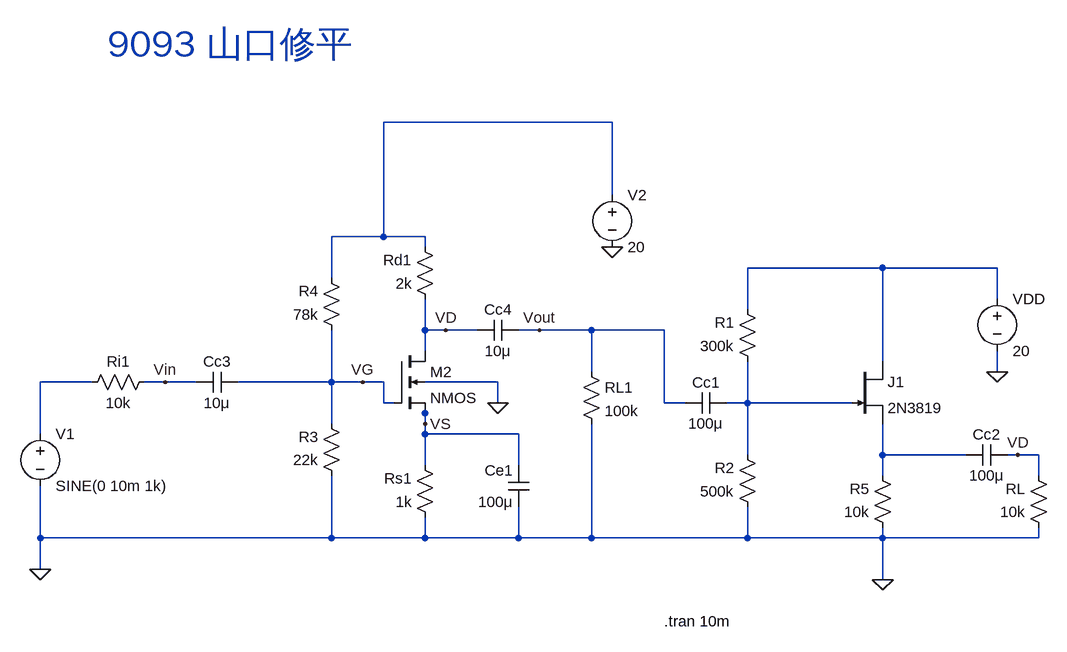
[diagram p0: schematic Draft3.asc]
Draft3.asc, the LTspice schematic file:
Version 4
SHEET 1 1700 776
WIRE 1024 -128 672 -128
WIRE 1024 -16 1024 -128
WIRE 672 48 672 -128
WIRE 672 48 592 48
WIRE 736 48 672 48
WIRE 736 64 736 48
WIRE 1440 96 1232 96
WIRE 1616 96 1440 96
WIRE 592 112 592 48
WIRE 1616 144 1616 96
WIRE 1232 160 1232 96
WIRE 736 192 736 144
WIRE 768 192 736 192
WIRE 816 192 768 192
WIRE 912 192 880 192
WIRE 992 192 912 192
WIRE 1104 192 992 192
WIRE 736 224 736 192
WIRE 1440 240 1440 96
WIRE 992 256 992 192
WIRE 1616 256 1616 224
WIRE 224 272 144 272
WIRE 336 272 304 272
WIRE 384 272 336 272
WIRE 592 272 592 192
WIRE 592 272 448 272
WIRE 640 272 592 272
WIRE 672 272 640 272
WIRE 848 272 736 272
WIRE 672 304 672 272
WIRE 688 304 672 304
WIRE 848 304 848 272
WIRE 1104 304 1104 192
WIRE 1136 304 1104 304
WIRE 1232 304 1232 240
WIRE 1232 304 1200 304
WIRE 1392 304 1232 304
WIRE 736 320 736 304
WIRE 592 336 592 272
WIRE 736 336 736 320
WIRE 144 352 144 272
WIRE 736 352 736 336
WIRE 880 352 736 352
WIRE 1232 384 1232 304
WIRE 1440 384 1440 336
WIRE 1568 384 1440 384
WIRE 1648 384 1632 384
WIRE 1680 384 1648 384
WIRE 736 400 736 352
WIRE 880 400 880 352
WIRE 1440 416 1440 384
WIRE 1680 416 1680 384
WIRE 144 512 144 432
WIRE 592 512 592 416
WIRE 592 512 144 512
WIRE 736 512 736 480
WIRE 736 512 592 512
WIRE 880 512 880 464
WIRE 880 512 736 512
WIRE 992 512 992 336
WIRE 992 512 880 512
WIRE 1232 512 1232 464
WIRE 1232 512 992 512
WIRE 1440 512 1440 496
WIRE 1440 512 1232 512
WIRE 1680 512 1680 496
WIRE 1680 512 1440 512
WIRE 144 560 144 512
WIRE 1440 576 1440 512
FLAG 1024 64 0
FLAG 1616 256 0
FLAG 768 192 VD
FLAG 1648 384 VD
FLAG 336 272 Vin
FLAG 640 272 VG
FLAG 912 192 Vout
FLAG 144 560 0
FLAG 736 336 VS
FLAG 848 304 0
FLAG 1440 576 0
SYMBOL voltage 144 336 R0
SYMATTR InstName V1
SYMATTR Value SINE(0 10m 1k)
SYMBOL voltage 1024 -32 R0
SYMATTR InstName V2
SYMATTR Value 20
SYMBOL voltage 1616 128 R0
SYMATTR InstName VDD
SYMATTR Value 20
SYMBOL res 320 256 R90
WINDOW 0 0 56 VBottom 2
WINDOW 3 32 56 VTop 2
SYMATTR InstName Ri1
SYMATTR Value 10k
SYMBOL res 608 208 R180
WINDOW 0 36 76 Left 2
WINDOW 3 36 40 Left 2
SYMATTR InstName R4
SYMATTR Value 78k
SYMBOL res 752 160 R180
WINDOW 0 36 76 Left 2
WINDOW 3 36 40 Left 2
SYMATTR InstName Rd1
SYMATTR Value 2k
SYMBOL res 608 432 R180
WINDOW 0 36 76 Left 2
WINDOW 3 36 40 Left 2
SYMATTR InstName R3
SYMATTR Value 22k
SYMBOL res 752 496 R180
WINDOW 0 36 76 Left 2
WINDOW 3 36 40 Left 2
SYMATTR InstName Rs1
SYMATTR Value 1k
SYMBOL res 1248 480 R180
WINDOW 0 36 76 Left 2
WINDOW 3 36 40 Left 2
SYMATTR InstName R2
SYMATTR Value 500k
SYMBOL res 1456 512 R180
WINDOW 0 36 76 Left 2
WINDOW 3 36 40 Left 2
SYMATTR InstName R5
SYMATTR Value 10k
SYMBOL res 1696 512 R180
WINDOW 0 36 76 Left 2
WINDOW 3 36 40 Left 2
SYMATTR InstName RL
SYMATTR Value 10k
SYMBOL res 1248 256 R180
WINDOW 0 36 76 Left 2
WINDOW 3 36 40 Left 2
SYMATTR InstName R1
SYMATTR Value 300k
SYMBOL cap 448 256 R90
WINDOW 0 0 32 VBottom 2
WINDOW 3 32 32 VTop 2
SYMATTR InstName Cc3
SYMATTR Value 10μ
SYMBOL cap 880 176 R90
WINDOW 0 0 32 VBottom 2
WINDOW 3 32 32 VTop 2
SYMATTR InstName Cc4
SYMATTR Value 10μ
SYMBOL cap 1200 288 R90
WINDOW 0 0 32 VBottom 2
WINDOW 3 32 32 VTop 2
SYMATTR InstName Cc1
SYMATTR Value 100μ
SYMBOL cap 1632 368 R90
WINDOW 0 0 32 VBottom 2
WINDOW 3 32 32 VTop 2
SYMATTR InstName Cc2
SYMATTR Value 100μ
SYMBOL cap 896 464 R180
WINDOW 0 24 56 Left 2
WINDOW 3 24 8 Left 2
SYMATTR InstName Ce1
SYMATTR Value 100μ
SYMBOL njf 1392 240 R0
SYMATTR InstName J1
SYMATTR Value 2N3819
SYMBOL res 976 240 R0
SYMATTR InstName RL1
SYMATTR Value 100k
SYMBOL nmos4 688 224 R0
SYMATTR InstName M2
SYMATTR Value2 l=5μ w=300μ
TEXT 1104 640 Left 2 !.tran 10m
TEXT 248 -248 Left 5 ;9093 山口修平

The netlist it stands for:
* Draft3.asc
V1 N003 0 SINE(0 10m 1k)
V2 N001 0 20
VDD N002 0 20
Ri1 Vin N003 10k
R4 VG N001 78k
Rd1 VD N001 2k
R3 0 VG 22k
Rs1 0 VS 1k
R2 0 N004 500k
R5 0 N005 10k
RL 0 VD 10k
R1 N004 N002 300k
Cc3 VG Vin 10μ
Cc4 Vout VD 10μ
Cc1 N004 Vout 100μ
Cc2 VD N005 100μ
Ce1 0 VS 100μ
J1 N002 N004 N005 2N3819
RL1 Vout 0 100k
M2 VD VG VS 0 NMOS l=5μ w=300μ
.model NJF NJF
.model PJF PJF
.lib standard.jft
.model NMOS NMOS
.model PMOS PMOS
.lib standard.mos
.tran 10m
* 9093 山口修平
.backanno
.end